# Altium project Lab1 wire lab.PrjPCB
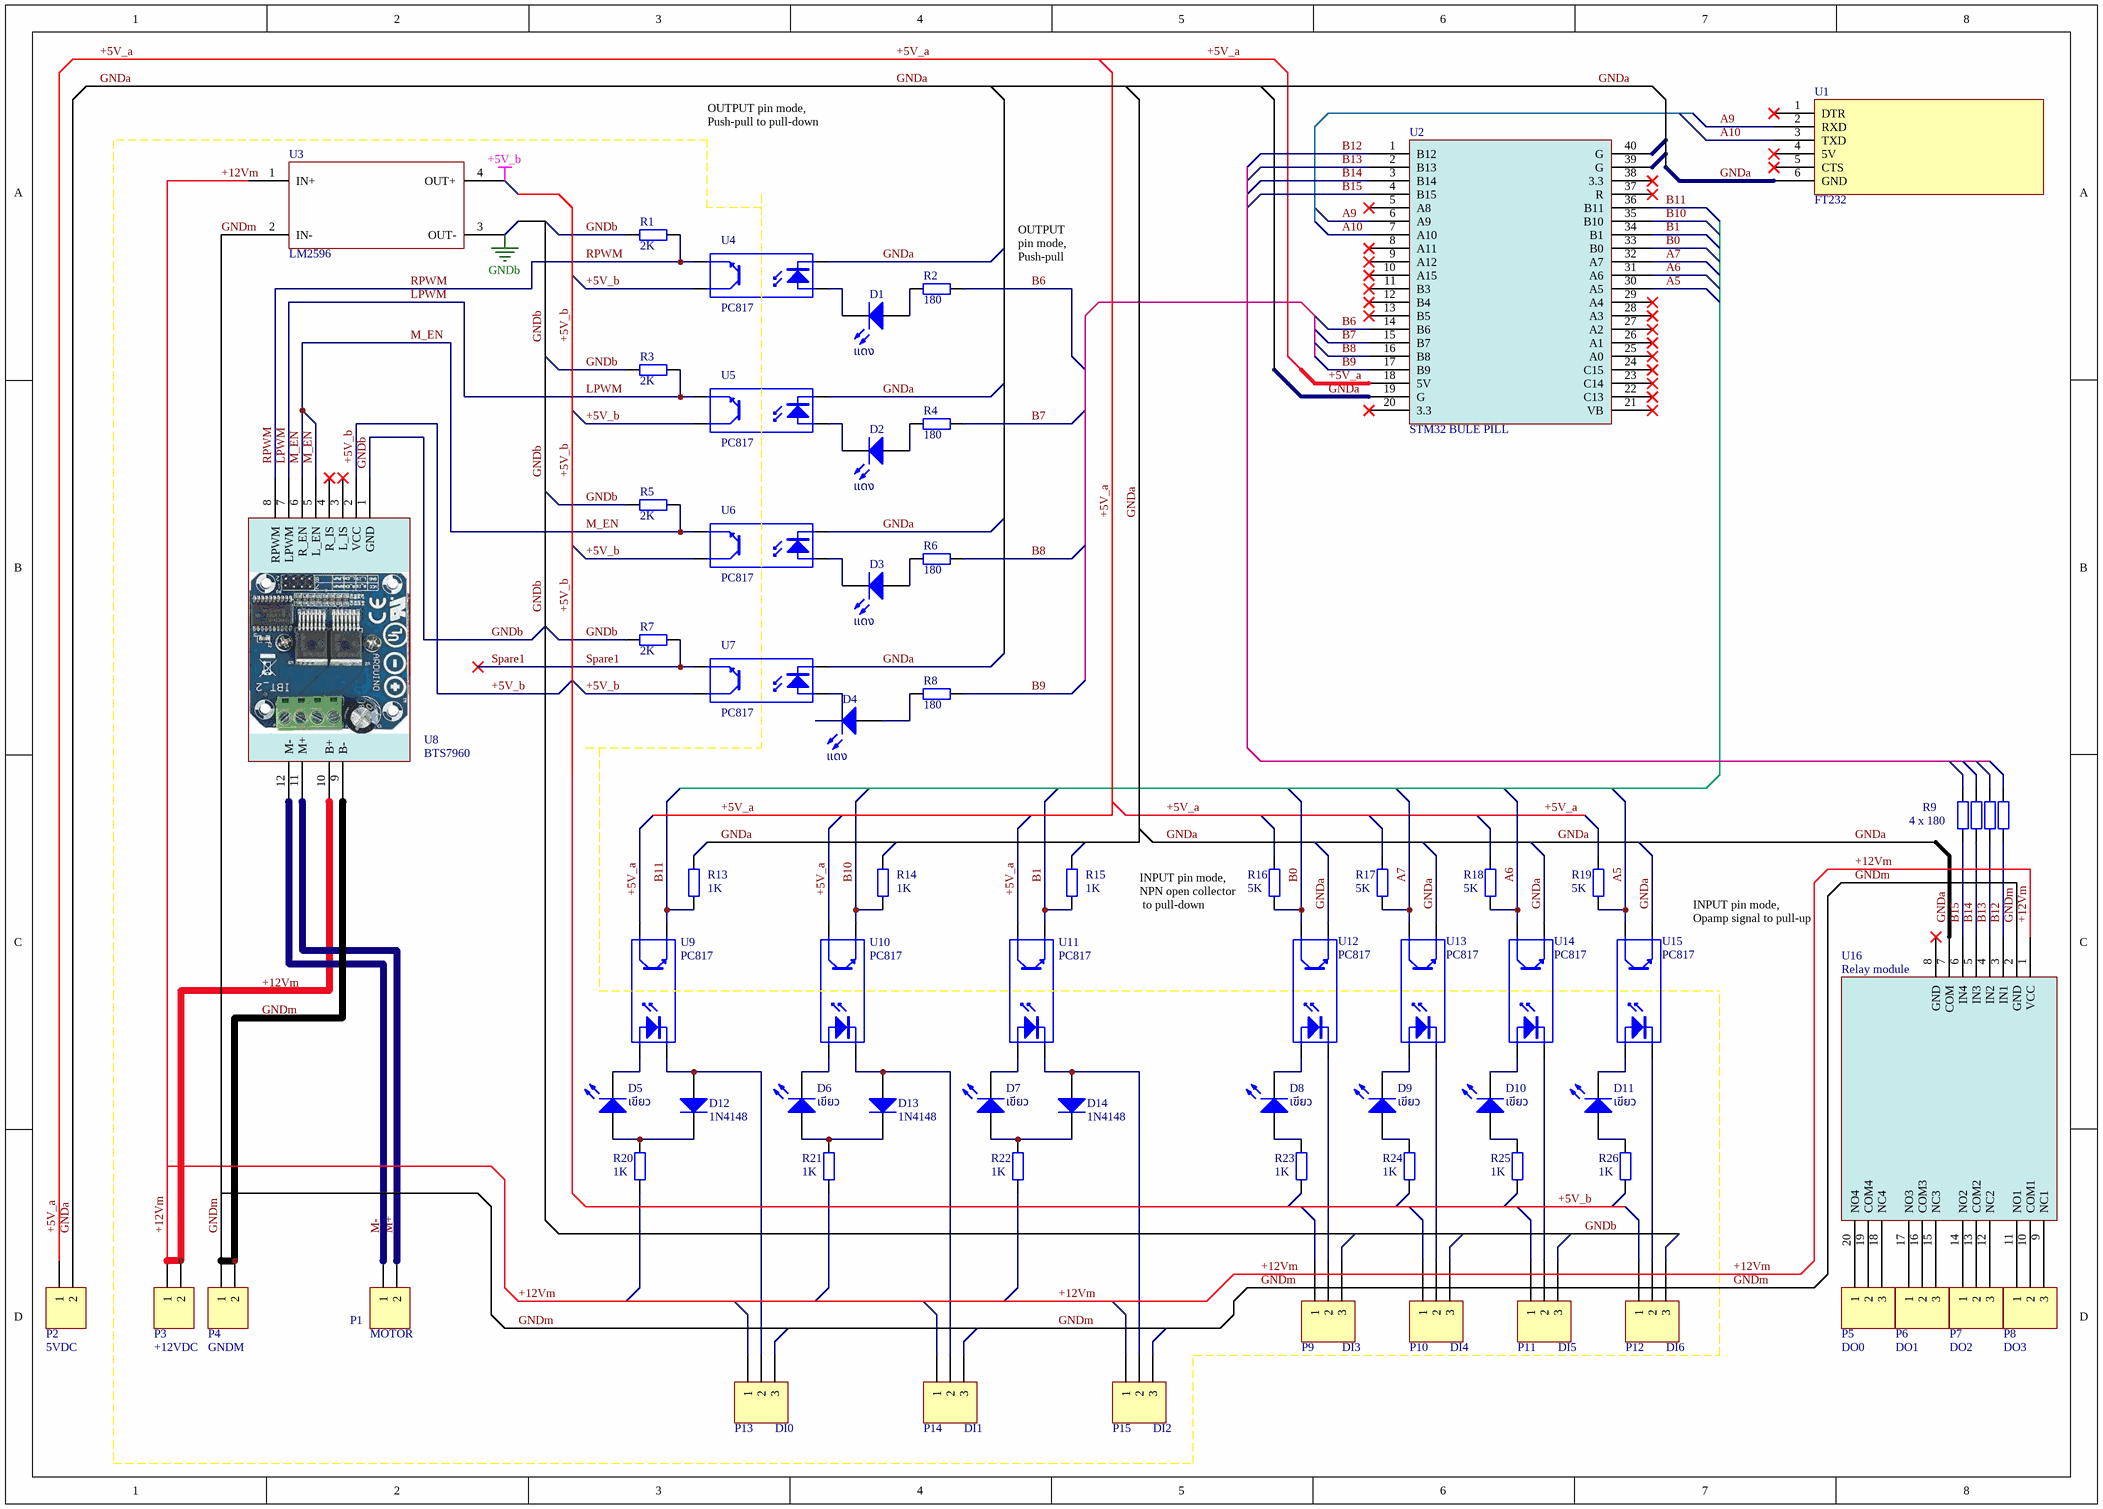
[diagram p0: Wire lab 1.SchDoc]
3 sheets, 71 parts. Net scope: global (net labels, ports and power ports of the same name join across sheets).
Sheets:
  Wire lab 1.SchDoc
  PIN out.SchDoc
  Prototype zoom 1.SchDoc

## Sheet Wire lab 1.SchDoc: ISOLATED MOTOR CTL
size A3; ApprovedBy: NHOPPASIT S.; DrawnBy: NHOPPASIT S.; DocumentNumber: WL-01; Revision: 1; SheetNumber: 1; SheetTotal: 1; PageSetup: Record=PageOptions|CenterHorizontal=True|CenterVertical=True|PrintScale=1.06|XCorrection=1.00|YCorrection=1.00|PrintKind=0|BorderSize=5000000|LeftOffset=0|BottomOffset=0|Orientation=2|PaperLength=4290|PaperWidth=3060|Scale=100|PaperSource=7|PrintQuality=-3|MediaType=1|DitherType=10|PrintScaleMode=1|PaperKind=A3 (Borderless) (11.7 x 16.5 in)|PaperIndex=283; Size: A4

### Parts
D1  แดง  [LED-0]
D2  แดง  [LED-0]
D3  แดง  [LED-0]
D4  แดง  [LED-0]
D5  เขียว  [LED-0]
D6  เขียว  [LED-0]
D7  เขียว  [LED-0]
D8  เขียว  [LED-0]
D9  เขียว  [LED-0]
D10  เขียว  [LED-0]
D11  เขียว  [LED-0]
D12  1N4148  [DO-35]
D13  1N4148  [DO-35]
D14  1N4148  [DO-35]
P1  MOTOR  [HDR1X2]
P2  5VDC  [HDR1X2]
P3  +12VDC  [HDR1X2]
P4  GNDM  [HDR1X2]
P5  DO0  [HDR1X3]
P6  DO1  [HDR1X3]
P7  DO2  [HDR1X3]
P8  DO3  [HDR1X3]
P9  DI3  [HDR1X3]
P10  DI4  [HDR1X3]
P11  DI5  [HDR1X3]
P12  DI6  [HDR1X3]
P13  DI0  [HDR1X3]
P14  DI1  [HDR1X3]
P15  DI2  [HDR1X3]
R1  2K  [AXIAL-0.4]
R2  180  [AXIAL-0.4]
R3  2K  [AXIAL-0.4]
R4  180  [AXIAL-0.4]
R5  2K  [AXIAL-0.4]
R6  180  [AXIAL-0.4]
R7  2K  [AXIAL-0.4]
R8  180  [AXIAL-0.4]
R9  180  [AXIAL-0.4]  (value not drawn)
R10  180  [AXIAL-0.4]  (value not drawn)
R11  180  [AXIAL-0.4]  (value not drawn)
R12  180  [AXIAL-0.4]  (value not drawn)
R13  1K  [AXIAL-0.4]
R14  1K  [AXIAL-0.4]
R15  1K  [AXIAL-0.4]
R16  5K  [AXIAL-0.4]
R17  5K  [AXIAL-0.4]
R18  5K  [AXIAL-0.4]
R19  5K  [AXIAL-0.4]
R20  1K  [AXIAL-0.4]
R21  1K  [AXIAL-0.4]
R22  1K  [AXIAL-0.4]
R23  1K  [AXIAL-0.4]
R24  1K  [AXIAL-0.4]
R25  1K  [AXIAL-0.4]
R26  1K  [AXIAL-0.4]
U1  FT232
U2  STM32 BULE PILL  [STM32 BLUE PILL]
U3  LM2596
U4  PC817  [DIP-4]
U5  PC817  [DIP-4]
U6  PC817  [DIP-4]
U7  PC817  [DIP-4]
U8  BTS7960
U9  PC817  [DIP-4]
U10  PC817  [DIP-4]
U11  PC817  [DIP-4]
U12  PC817  [DIP-4]
U13  PC817  [DIP-4]
U14  PC817  [DIP-4]
U15  PC817  [DIP-4]
U16  Relay module

### Nets
+5V_b: U3.4(OUT+) U4.4(C) U5.4(C) U6.4(C) U7.4(C) U8.2(VCC)
GNDb: R1.1 R3.2 R5.2 R7.2 U3.3(OUT-) U8.1(GND)
+5V_a: U2.18(5V) U9.4(C) U10.4(C) U11.4(C)
+12Vm: P3.1 P3.2 U8.10(B+)
A5: R19.1 U2.30(A5) U15.4(C)
A6: R18.1 U2.31(A6) U14.4(C)
A7: R17.1 U2.32(A7) U13.4(C)
A9: U1.2(RXD) U2.6(A9)
A10: U1.3(TXD) U2.7(A10)
B0: R16.1 U2.33(B0) U12.4(C)
B1: R15.1 U2.34(B1) U11.3(E)
B6: R2.2 U2.14(B6)
B7: R4.2 U2.15(B7)
B8: R6.2 U2.16(B8)
B9: R8.2 U2.17(B9)
B10: R14.1 U2.35(B10) U10.3(E)
B11: R13.1 U2.36(B11) U9.3(E)
B12: R12.1 U2.1(B12) U16.3(IN1)
B13: R11.1 U2.2(B13) U16.4(IN2)
B14: R10.1 U2.3(B14) U16.5(IN3)
B15: R9.1 U2.4(B15) U16.6(IN4)
GNDa: U1.6(GND) U2.19(G) U4.2(K) U5.2(K) U6.2(K) U7.2(K) U12.3(E) U13.3(E) U14.3(E) U15.3(E) U16.7(COM)
GNDm: P4.1 P4.2 U8.9(B-)
LPWM: R3.1 U5.3(E) U8.7(LPWM)
M+: P1.2 U8.11(M+)
M-: P1.1 U8.12(M-)
M_EN: R5.1 U6.3(E) U8.5(L_EN) U8.6(R_EN)
RPWM: R1.2 U4.3(E) U8.8(RPWM)
Spare1: R7.1 U7.3(E)
NetD1_1: D1.1(A) R2.1
NetD1_2: D1.2(K) U4.1(A)
NetD2_1: D2.1(A) R4.1
NetD2_2: D2.2(K) U5.1(A)
NetD3_1: D3.1(A) R6.1
NetD3_2: D3.2(K) U6.1(A)
NetD4_1: D4.1(A) R8.1
NetD4_2: D4.2(K) U7.1(A)
NetD5_1: D5.1(A) D12.2(K) R20.2
NetD5_2: D5.2(K) U9.1(A)
NetD6_1: D6.1(A) D13.2(K) R21.2
NetD6_2: D6.2(K) U10.1(A)
NetD7_1: D7.1(A) D14.2(K) R22.2
NetD7_2: D7.2(K) U11.1(A)
NetD8_1: D8.1(A) R23.2
NetD8_2: D8.2(K) U12.1(A)
NetD9_1: D9.1(A) R24.2
NetD9_2: D9.2(K) U13.1(A)
NetD10_1: D10.1(A) R25.2
NetD10_2: D10.2(K) U14.1(A)
NetD11_1: D11.1(A) R26.2
NetD11_2: D11.2(K) U15.1(A)
NetD12_1: D12.1(A) P13.2 U9.2(K)
NetD13_1: D13.1(A) P14.2 U10.2(K)
NetD14_1: D14.1(A) P15.2 U11.2(K)
NetP5_1: P5.1 U16.20(NO4)
NetP5_2: P5.2 U16.19(COM4)
NetP5_3: P5.3 U16.18(NC4)
NetP6_1: P6.1 U16.17(NO3)
NetP6_2: P6.2 U16.16(COM3)
NetP6_3: P6.3 U16.15(NC3)
NetP7_1: P7.1 U16.14(NO2)
NetP7_2: P7.2 U16.13(COM2)
NetP7_3: P7.3 U16.12(NC2)
NetP8_1: P8.1 U16.11(NO1)
NetP8_2: P8.2 U16.10(COM1)
NetP8_3: P8.3 U16.9(NC1)
NetP9_2: P9.2 U12.2(K)
NetP10_2: P10.2 U13.2(K)
NetP11_2: P11.2 U14.2(K)
NetP12_2: P12.2 U15.2(K)

Not connected (* = marked no-connect by the designer): P2 1 2; P9 1 3; P10 1 3; P11 1 3; P12 1 3; P13 1 3; P14 1 3; P15 1 3; R9 2; R10 2; R11 2; R12 2; R13 2; R14 2; R15 2; R16 2; R17 2; R18 2; R19 2; R20 1; R21 1; R22 1; R23 1; R24 1; R25 1; R26 1; U1 1(DTR)* 4(5V)* 5(CTS)*; U2 5(A8)* 8(A11)* 9(A12)* 10(A15)* 11(B3)* 12(B4)* 13(B5)* 20(3.3)* 21(VB)* 22(C13)* 23(C14)* 24(C15)* 25(A0)* 26(A1)* 27(A2)* 28(A3)* 29(A4)* 37(R)* 38(3.3)* 39(G) 40(G); U3 1(IN+) 2(IN-); U8 3(L_IS)* 4(R_IS)*; U16 1(VCC) 2(GND) 8(GND)*

### Buses and harness runs
bus +5V_a
bus +5V_b
bus +12Vm
bus GNDa
bus GNDb
bus GNDm

### Notes on the sheet
- OUTPUT pin mode,
  Push-pull to pull-down
- OUTPUT
  pin mode,
  Push-pull
- (near R9) 4 x 180
- (near R16) INPUT pin mode,
  NPN open collector
  to pull-down
- INPUT pin mode,
  Opamp signal to pull-up

### Library data of the parts
D1-D11 = LED0: Typical INFRARED GaAs LED; Published: 8-Jun-2000; LatestRevisionDate: 08-Jul-2005; LatestRevisionNote: Mech Layer 1 removed.; PackageReference: LED-0; Publisher: Altium Limited; PackageDescription: LED; 2 Leads
D12-D14 = Diode 1N4148: High Conductance Fast Diode; Published: 8-Jun-2000; LatestRevisionDate: 17-Jul-2002; LatestRevisionNote: Re-released for DXP Platform.; DatasheetVersion: 1997; PackageReference: DO-35; Publisher: Altium Limited; PackageDescription: Diode, Axial; Body 3.8 x 1.9 mm (LxDia. max), Lead Dia. 0.53 mm (max); Code_JEDEC: DO-204-AH; ComponentLink1Description: Manufacturer Link; ComponentLink1URL: http://www.fairchildsemi.com/; ComponentLink2Description: Datasheet; ComponentLink2URL: http://www.fairchildsemi.com/ds/1N%2F1N4148.pdf
P1-P4 = Header 2: Header, 2-Pin; LatestRevisionDate: 17-Jul-2002; LatestRevisionNote: Re-released for DXP Platform.; Publisher: Altium Limited
P5-P15 = Header 3: Header, 3-Pin; LatestRevisionDate: 17-Jul-2002; LatestRevisionNote: Re-released for DXP Platform.; Publisher: Altium Limited
R1-R26 = Res2: Resistor; Published: 8-Jun-2000; LatestRevisionDate: 17-Jul-2002; LatestRevisionNote: Re-released for DXP Platform.; PackageReference: AXIAL-0.4; Publisher: Altium Limited; PackageDescription: Axial Device, Thru-Hole; 2 Leads; 0.4 in Pin Spacing
  R1 R3 R5 R7: Value: 2K
  R2 R4 R6 R8-R12: Value: 180
  R13-R15 R20-R26: Value: 1K
  R16-R19: Value: 5K
U1 = FTDI-6P: FTDI Platinum Program Downloader USB TTL FT232 Chip
U3 = LM2596 Step down
U4-U7 U9-U15 = Optoisolator1: 4-Pin Phototransistor Optocoupler; Published: 24-Mar-1999; LatestRevisionDate: 04-Mar-2005; LatestRevisionNote: Sch pins 3 & 4 Swapped.; DatasheetVersion: Nov-2003; PackageReference: DIP-4; Publisher: Altium Limited
U8 = BTS7960: Motor Drive Module (BTS7960) - 43A with H-Bridge
U16 = 4 x 5V Relay Keyes

## Sheet PIN out.SchDoc: PAPER-X VERSION 2
size A3; ApprovedBy: NHOPPASIT S.; DrawnBy: NHOPPASIT S.; DocumentNumber: WL-02; Revision: -; SheetNumber: 1; SheetTotal: 1; Size: A4; PageSetup: Record=PageOptions|CenterHorizontal=True|CenterVertical=True|PrintScale=0.71|XCorrection=1.00|YCorrection=1.00|PrintKind=0|BorderSize=5000000|LeftOffset=0|BottomOffset=0|Orientation=2|PaperLength=2970|PaperWidth=2100|Scale=100|PaperSource=7|PrintQuality=-3|MediaType=1|DitherType=10|PrintScaleMode=1|PaperKind=A4 (8.3 x 11.7 in)|PaperIndex=9; DocumentName: PINOUT

## Sheet Prototype zoom 1.SchDoc
size A3; Size: A4; PageSetup: Record=PageOptions|CenterHorizontal=True|CenterVertical=True|PrintScale=1.06|XCorrection=1.00|YCorrection=1.00|PrintKind=0|BorderSize=5000000|LeftOffset=0|BottomOffset=0|Orientation=2|PaperLength=4290|PaperWidth=3060|Scale=100|PaperSource=7|PrintQuality=-3|MediaType=1|DitherType=10|PrintScaleMode=1|PaperKind=A3 (Borderless) (11.7 x 16.5 in)|PaperIndex=283